# EAGLE design 00A-120 (EAGLE 9.6.2)
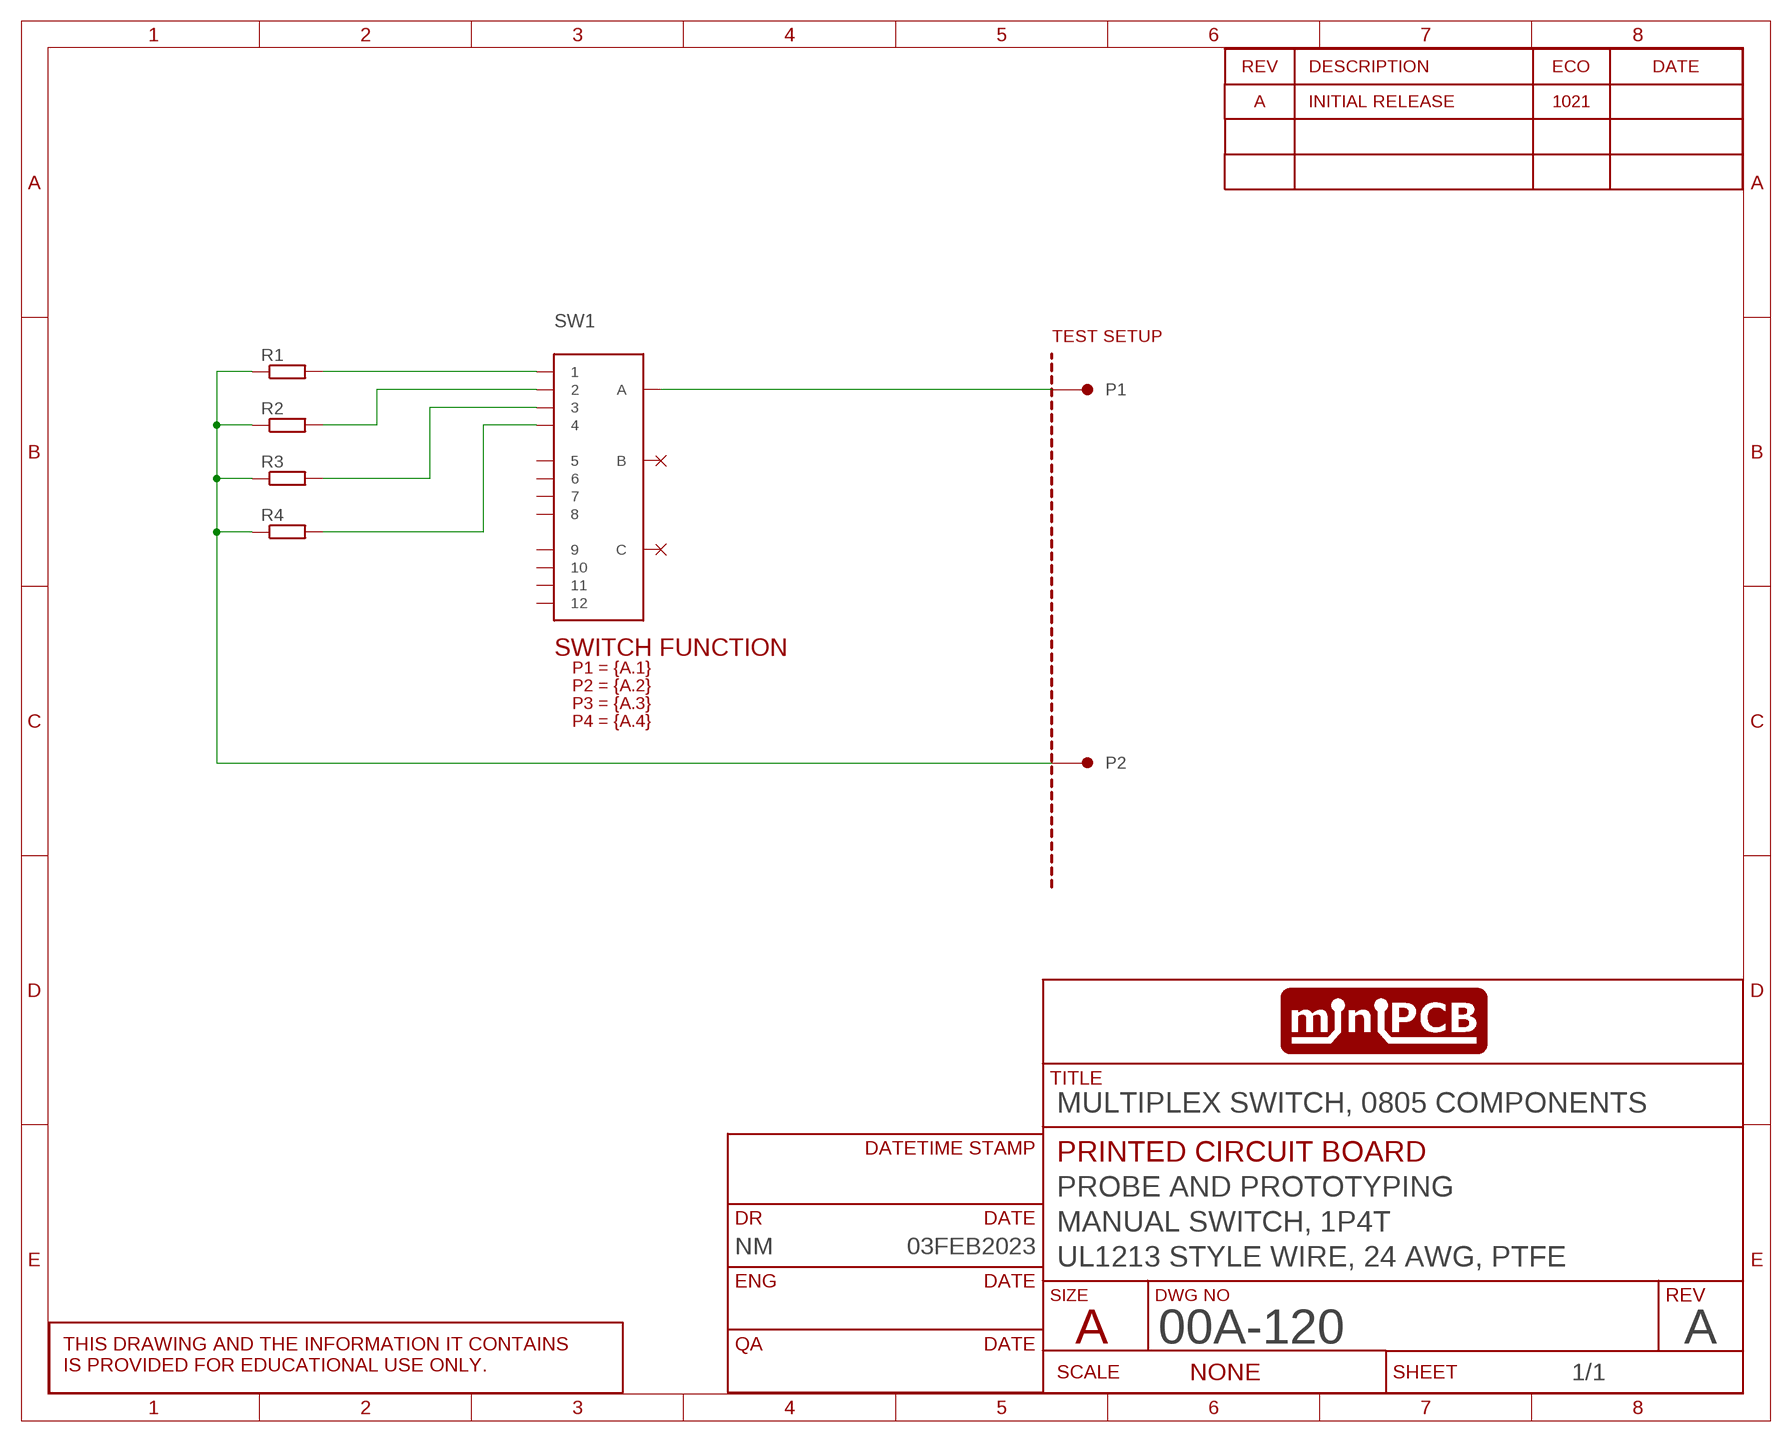
[diagram p0: schematic, sheet 1]
SHEET1 (SCHEMATIC): CIRCUIT_CATEGORY: PROBE AND PROTOTYPING; CIRCUIT_NAME: MANUAL SWITCH, 1P4T; CIRCUIT_VARIANT: UL1213 STYLE WIRE, 24 AWG, PTFE; DR: NM; DR_DATE: 03FEB2023; PCB_PCBA: PRINTED CIRCUIT BOARD; REVA: A; REVA_ECO: 1021; REVISION: A; TITLE: MULTIPLEX SWITCH, 0805 COMPONENTS

## Parts
P1  PINS_124AWG-NOTEXT  [PINS_1_1MM-NOTEXT]
P2  PINS_124AWG-NOTEXT  [PINS_1_1MM-NOTEXT]
PCB1  MINIPCB_0P50X50  [MINIPCB_0P_50X50MM]
R1  RESISTORSMD  [R0805]
R2  RESISTORSMD  [R0805]
R3  RESISTORSMD  [R0805]
R4  RESISTORSMD  [R0805]
SW1  SWITCH-ROTARY-3P4T  [SWITCH-ROTARY-3P4T]

## Nets
N$1: P1.1 P1.2 SW1.A
N$2: R1.2 SW1.1
N$3: R2.2 SW1.2
N$4: R3.2 SW1.3
N$5: R4.2 SW1.4
N$14: P2.1 P2.2 R1.1 R2.1 R3.1 R4.1
Unconnected: SW1.5 SW1.6 SW1.7 SW1.8 SW1.9 SW1.10 SW1.11 SW1.12 SW1.B SW1.C

## Library data of the parts
P1 P2 = minipcb:PINS_1
PCB1 = minipcb:MINIPCB_0P; NAME1: TEST SETUP; PART_NUMBER: 00A-120-A; REVISION: A
R1-R4 = minipcb:RESISTOR
SW1 = minipcb:SWITCH-ROTARY-3P4T

## Board
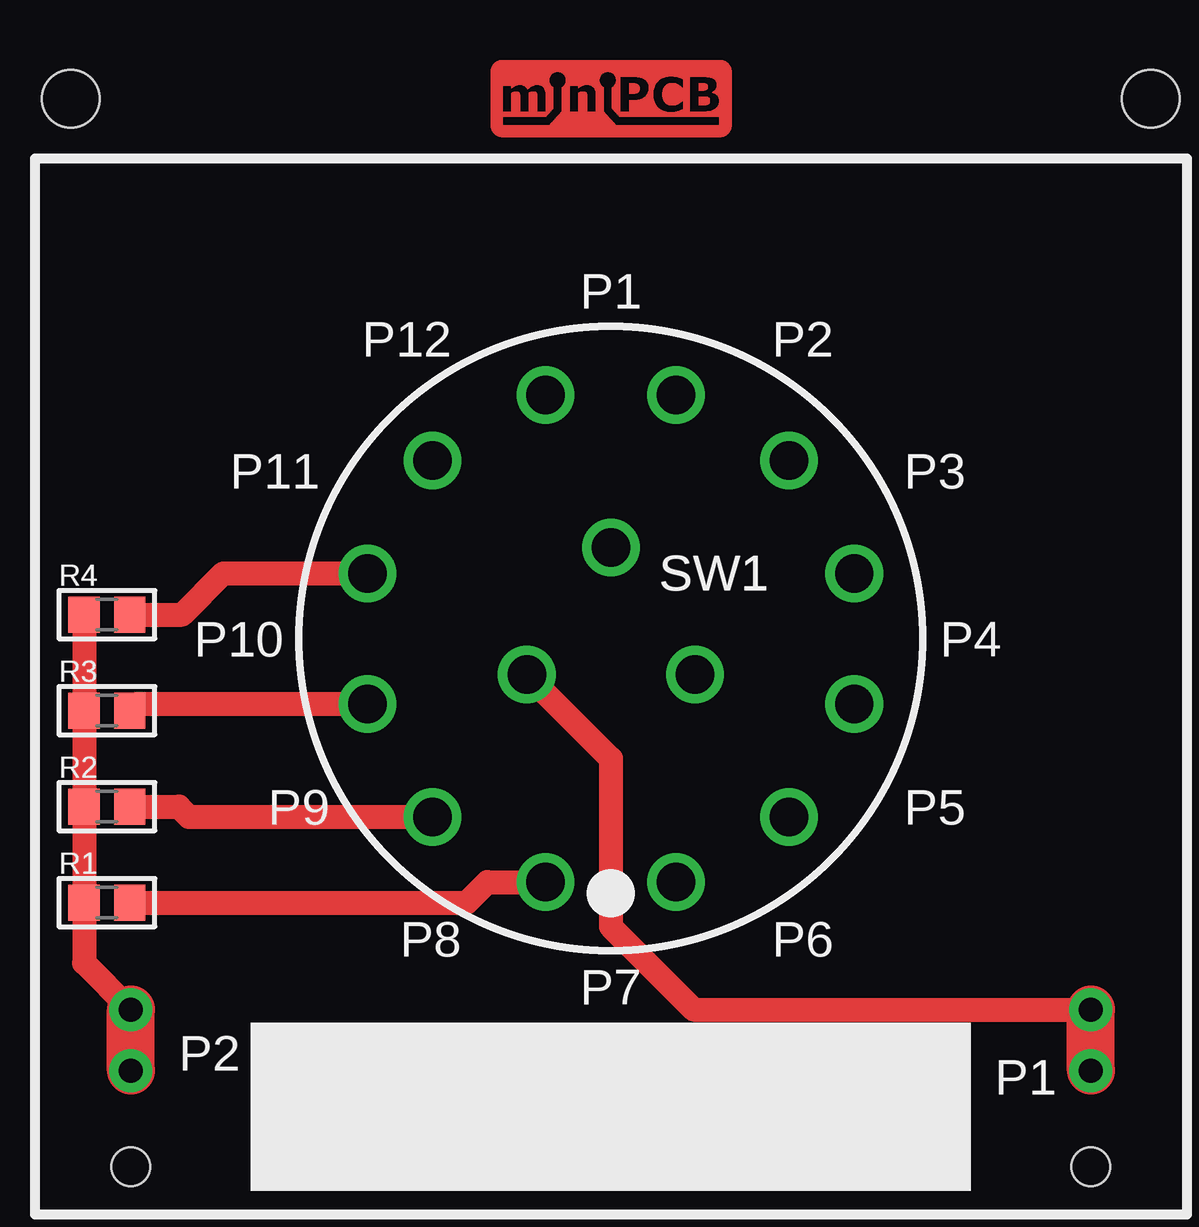
[diagram p1: board, top side]
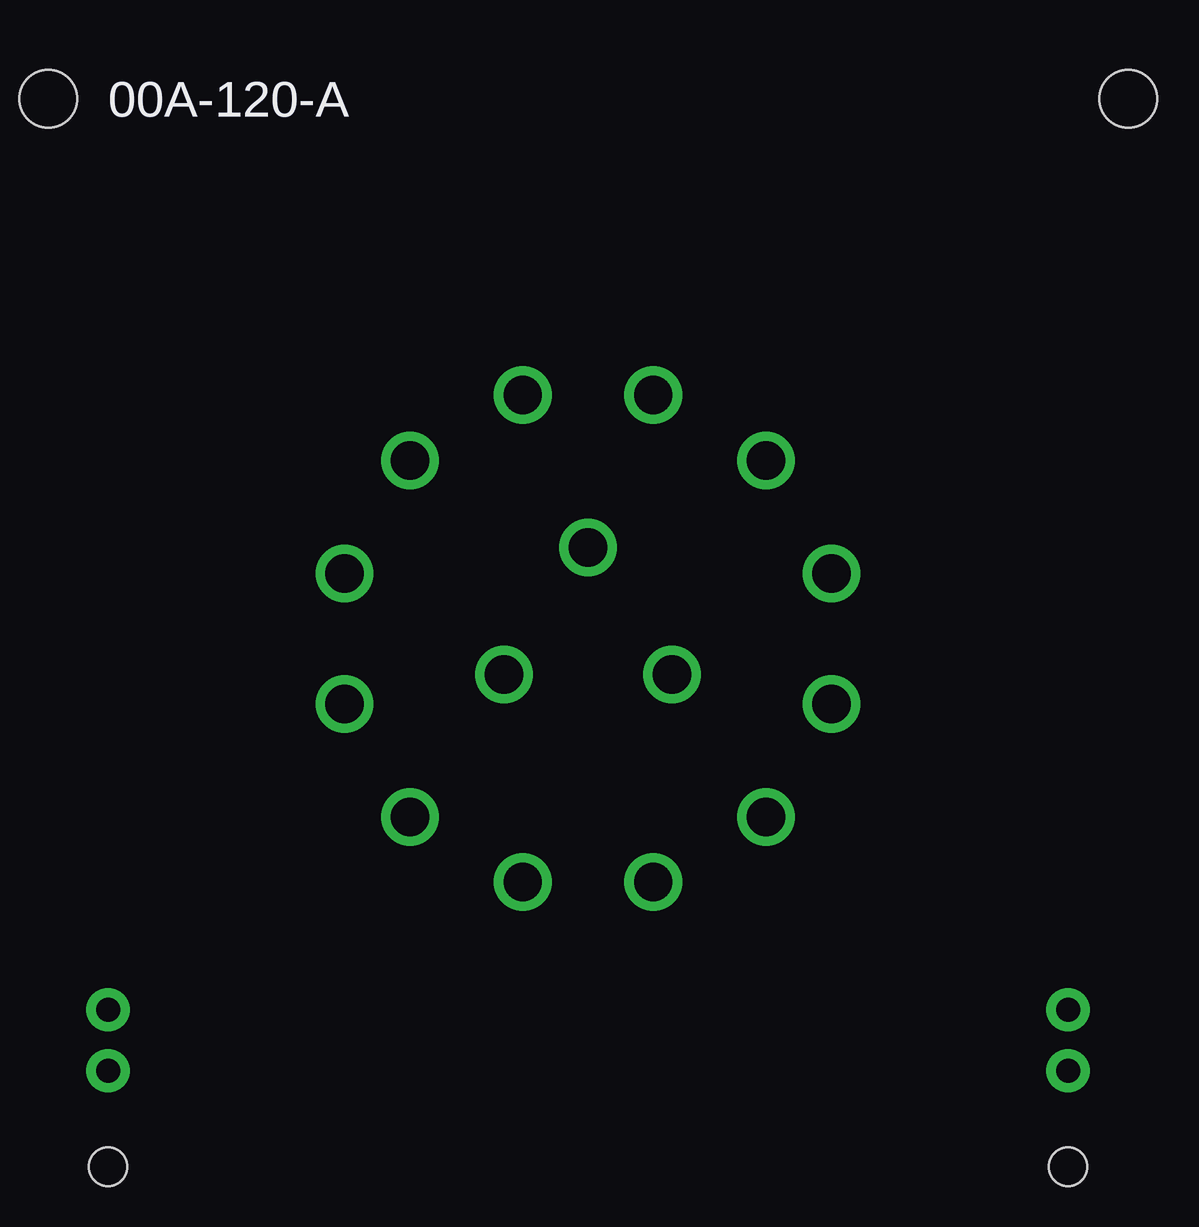
[diagram p2: board, bottom side, seen from below]

No outline drawn. Coordinates in mm, seen from the top.
Copper layers (1*16): Top 0.035mm / dielectric 1.5mm / Bottom 0.035mm
Design rules "minipcb": minimum track width 0.2mm, minimum drill 0.5mm, track to track 0.25mm, track to pad 0.5mm, pad to pad 0.5mm, via to via 0.5mm, smd to smd 0.15mm, copper to edge 1mm, drill to drill 1mm, minimum pad ring 0.4mm, minimum via ring 0.4mm, stop-mask expansion 0.1mm, vias tented up to drill 0.6mm, thermal gap 0.5mm

### Footprints (pad centres in the part's own frame; a part is rotated, then mirrored left to right if it is on the bottom)
PINS_1_1MM-NOTEXT = drill 1 pad 1.6: 1 4,0; 2 6.54,0 | hole 1.6: 0,0
MINIPCB_0P_50X50MM = hole 2.4: 47.5,47.5; 2.5,47.5
R0805 = smd 1.3 x 1.5: 1 -0.95,0; 2 0.95,0
SWITCH-ROTARY-3P4T = drill 1.6: 1 -2.718,-10.142; 2 -7.425,-7.425; 3 -10.142,-2.718; 4 -10.142,2.718; 5 -7.425,7.425; 6 -2.718,10.142; 7 2.718,10.142; 8 7.425,7.425; 9 10.142,2.718; 10 10.142,-2.718; 11 7.425,-7.425; 12 2.718,-10.142; A -3.5,-1.5; B 0,3.8; C 3.5,-1.5

### Placement (x,y rotation side)
P1  45,3 90 top
P2  5,3 90 top
PCB1  0,0 0 top
R1  4,14 0 top
R2  4,18 0 top
R3  4,22 0 top
R4  4,26 0 top
SW1  25,25 0 top

### Tracks (layer width: path | path; a pad name or v marks a point on that pad's centre or on a via)
N$1
  Top 1: SW1.A 25,20 25,13 28.46,9.54 P1.2
  Top 2: P1.1 P1.2
N$2
  Top 1: R1.2 19,14 19.86,14.86 SW1.1
N$3
  Top 1: R2.2 7,18 7.42,17.57 SW1.2
N$4
  Top 1: R3.2 5.23,22.28 SW1.3
N$5
  Top 1: R4.2 7.14,26 8.86,27.72 SW1.4
N$14
  Top 1: R4.1 R3.1 R2.1 R1.1 3.05,11.49 P2.2
  Top 2: P2.1 P2.2

### Text on the board
tPlace: P2 | P1
_tNames: R4 | SW1 | R3 | R2 | R1